# EAGLE design SOLv1.0 (EAGLE 9.6.2)
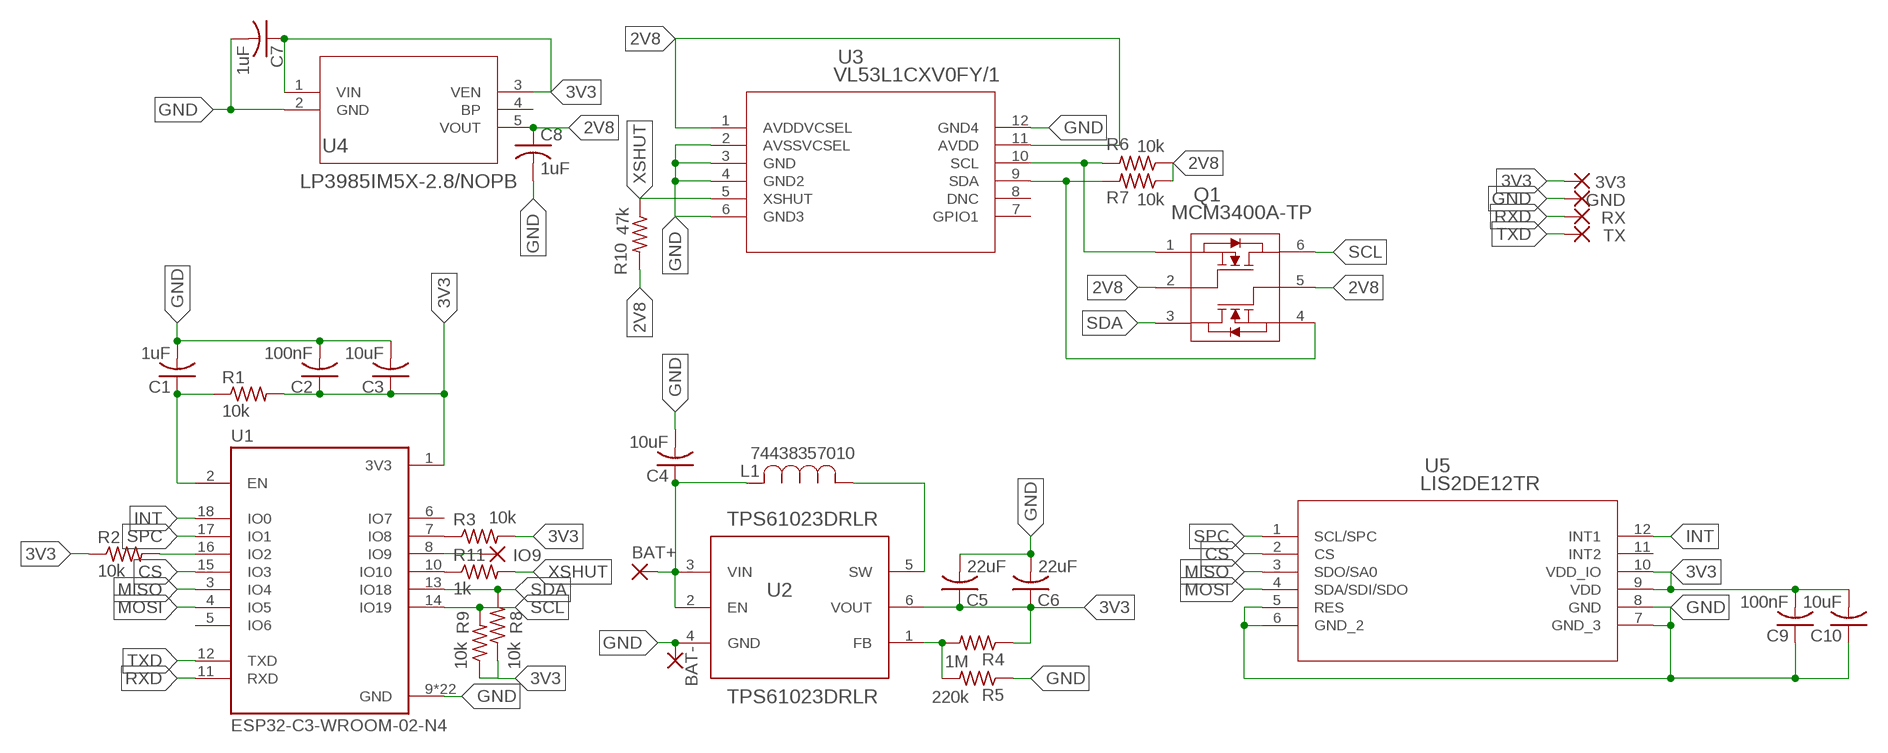
[diagram p0: schematic, sheet 1]

## Parts
3V3  1,6/0,8  [1,6/0,8]
BAT+  1,6/0,8  [1,6/0,8]
BAT-  1,6/0,8  [1,6/0,8]
C1  1uF  C-USC0805  [C0805]
C2  100nF  C-USC0805  [C0805]
C3  10uF  C-USC0805  [C0805]
C4  10uF  C-USC0805  [C0805]
C5  22uF  C-USC0805  [C0805]
C6  22uF  C-USC0805  [C0805]
C7  1uF  C-USC0805  [C0805]
C8  1uF  C-USC0805  [C0805]
C9  100nF  C-USC0805  [C0805]
C10  10uF  C-USC0805  [C0805]
GND  1,6/0,8  [1,6/0,8]
IO9  1,6/0,8  [1,6/0,8]
L1  74438357010  [IND_74438357010_WRE]
Q1  MCM3400A-TP  [DFN2020-6L_MCE]
R1  10k  R-US_R0805  [R0805]
R2  10k  R-US_R0805  [R0805]
R3  10k  R-US_R0805  [R0805]
R4  1M  R-US_R0805  [R0805]
R5  220k  R-US_R0805  [R0805]
R6  10k  R-US_R0805  [R0805]
R7  10k  R-US_R0805  [R0805]
R8  10k  R-US_R0805  [R0805]
R9  10k  R-US_R0805  [R0805]
R10  47k  R-US_R0805  [R0805]
R11  1k  R-US_R0805  [R0805]
RX  1,6/0,8  [1,6/0,8]
TX  1,6/0,8  [1,6/0,8]
U1  ESP32-C3-WROOM-02-N4  [MODULE_ESP32-C3-WROOM-02-H4]
U2  TPS61023DRLR  [DRL0006A]
U3  VL53L1CXV0FY/1  [LGA12_STM]
U4  LP3985IM5X-2.8/NOPB  [MF05A]
U5  LIS2DE12TR  [LGA-12_STM]

## Nets
2V8: C8.1 Q1.2 Q1.5 R6.1 R7.1 R10.2 U3.1(AVDDVCSEL) U3.11(AVDD) U4.5(VOUT)
3V3: 3V3.1(P) C2.1 C3.1 C5.1 C6.1 C7.1 C9.2 C10.2 R1.2 R2.1 R3.2 R4.1 R8.1 R9.1 U1.1(3V3) U2.6(VOUT) U4.1(VIN) U4.3(VEN) U5.9(VDD) U5.10(VDD_IO)
CS: U1.15(IO3) U5.2(CS)
GND: BAT-.1(P) C1.2 C2.2 C3.2 C4.2 C5.2 C6.2 C7.2 C8.2 C9.1 C10.1 GND.1(P) R5.1 U1.9(GND) U1.19(GND) U1.20(GND) U1.21(GND) U1.22(GND) U1.23(GND) U1.24(GND) U1.25(GND) U1.26(GND) U1.27(GND) U1.28(GND) U1.29(GND) U1.30(GND) U1.31(GND) U1.32(GND) U1.33(GND) U1.34(GND) U1.35(GND) U1.36(GND) U1.37(GND) U1.38(GND) U1.39(GND) U2.4(GND) U3.2(AVSSVCSEL) U3.3(GND) U3.4(GND2) U3.6(GND3) U3.12(GND4) U4.2(GND) U5.5(RES) U5.6(GND_2) U5.7(GND_3) U5.8(GND)
INT: U1.18(IO0) U5.12(INT1)
MISO: U1.3(IO4) U5.3(SDO/SA0)
MOSI: U1.4(IO5) U5.4(SDA/SDI/SDO)
N$1: R2.2 U1.16(IO2)
N$2: C1.1 R1.1 U1.2(EN)
N$3: R3.1 U1.7(IO8)
N$4: IO9.1(P) U1.8(IO9)
N$5: BAT+.1(P) C4.1 L1.2 U2.2(EN) U2.3(VIN)
N$6: L1.1 U2.5(SW)
N$7: R4.2 R5.2 U2.1(FB)
N$10: Q1.4 R7.2 U3.9(SDA)
N$11: R11.1 U1.10(IO10)
N$12: Q1.1 R6.2 U3.10(SCL)
RXD: RX.1(P) U1.11(RXD)
SCL: Q1.6 R9.2 U1.14(IO19)
SDA: Q1.3 R8.2 U1.13(IO18)
SPC: U1.17(IO1) U5.1(SCL/SPC)
TXD: TX.1(P) U1.12(TXD)
XSHUT: R10.1 R11.2 U3.5(XSHUT)
Unconnected: U1.5(IO6) U1.6(IO7) U3.7(GPIO1) U3.8(DNC) U4.4(BP) U5.11(INT2)

## Library data of the parts
3V3 BAT+ BAT- GND IO9 RX TX = wirepad:1,6/0,8: THROUGH-HOLE PAD
C1-C10 = rcl:C-US: CAPACITOR, American symbol; SPICEPREFIX: C
L1 = 74438357010:74438357010; COPYRIGHT: Copyright (C) 2024 Ultra Librarian. All rights reserved.; MANUFACTURER_PART_NUMBER: 74438357010; MFR_NAME: Wurth Electronics
Q1 = MCM3400A-TP:MCM3400A-TP; COPYRIGHT: Copyright (C) 2024 Ultra Librarian. All rights reserved.; MANUFACTURER_PART_NUMBER: MCM3400A-TP; MFR_NAME: MCC; TYPE: Transistors
R1-R11 = rcl:R-US_: RESISTOR, American symbol; SPICEPREFIX: R
U1 = ESP32-C3-WROOM-02-N4:ESP32-C3-WROOM-02-N4: WiFi Modules (802.11) (Engineering Samples) SMD module, ESP32-C3, 4MB SPI flash, PCB antenna, -40 C +105 C Check availability <https://pricing.snapeda.com/parts/ESP32-C3-WROOM-02-H4/Espressif%20Systems/view-part?ref=eda> Check availability <https://pricing.snapeda.com/parts/ESP32-C3-WROOM-02-N4/Espressif%20Systems/view-part?ref=eda>; AVAILABILITY: In Stock; CHECK_PRICES: https://www.snapeda.com/parts/ESP32-C3-WROOM-02-N4/Espressif+Systems/view-part/?ref=eda; DESCRIPTION: WiFi Modules (802.11) (Engineering Samples) SMD module, ESP32-C3, 4MB SPI flash, PCB antenna, -40 C +85 C; MF: Espressif Systems; MP: ESP32-C3-WROOM-02-N4; PACKAGE: Package; PRICE: None; SNAPEDA_LINK: https://www.snapeda.com/parts/ESP32-C3-WROOM-02-N4/Espressif+Systems/view-part/?ref=snap
U2 = TPS61023:TPS61023DRLR; COPYRIGHT: Copyright (C) 2024 Ultra Librarian. All rights reserved.; MANUFACTURER_PART_NUMBER: TPS61023DRLR; MFR_NAME: Texas Instruments; REFDES: RefDes; TYPE: TYPE
U3 = VL53L1X:VL53L1CXV0FY/1; COPYRIGHT: Copyright (C) 2024 Ultra Librarian. All rights reserved.; MANUFACTURER_PART_NUMBER: VL53L1CXV0FY/1; MFR_NAME: STMicroelectronics
U4 = LP3985IM5X-2.8:LP3985IM5X-2.8/NOPB; COPYRIGHT: Copyright (C) 2024 Ultra Librarian. All rights reserved.; MANUFACTURER_PART_NUMBER: LP3985IM5X-2.8/NOPB; MFR_NAME: Texas Instruments; TYPE: LP3985IM5-2.5
U5 = LIS2DE12TR:LIS2DE12TR; COPYRIGHT: Copyright (C) 2024 Ultra Librarian. All rights reserved.; MANUFACTURER_PART_NUMBER: LIS2DE12TR; MFR_NAME: STMicroelectronics

## Board
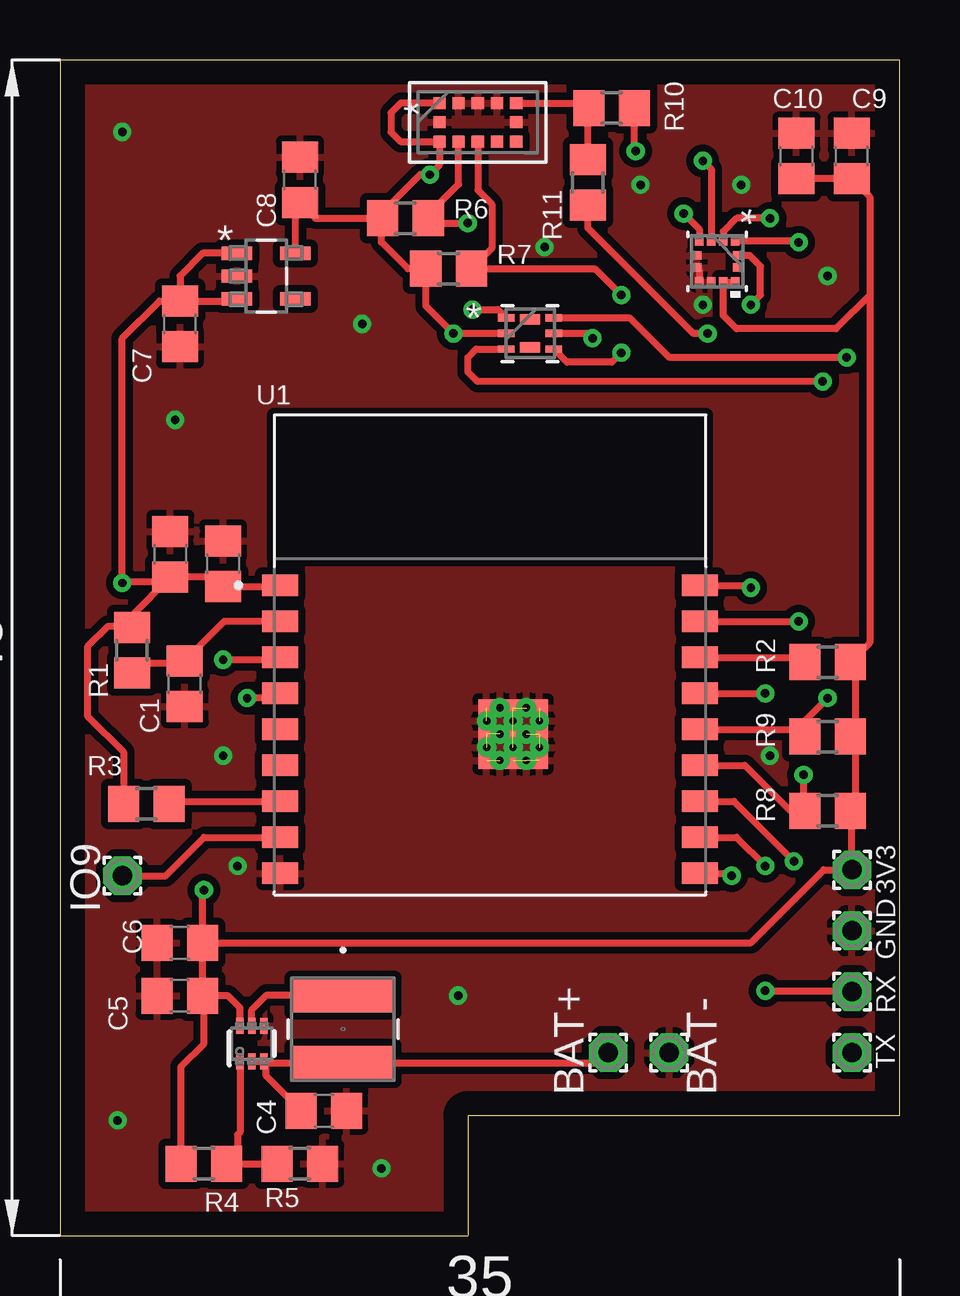
[diagram p1: board, top side]
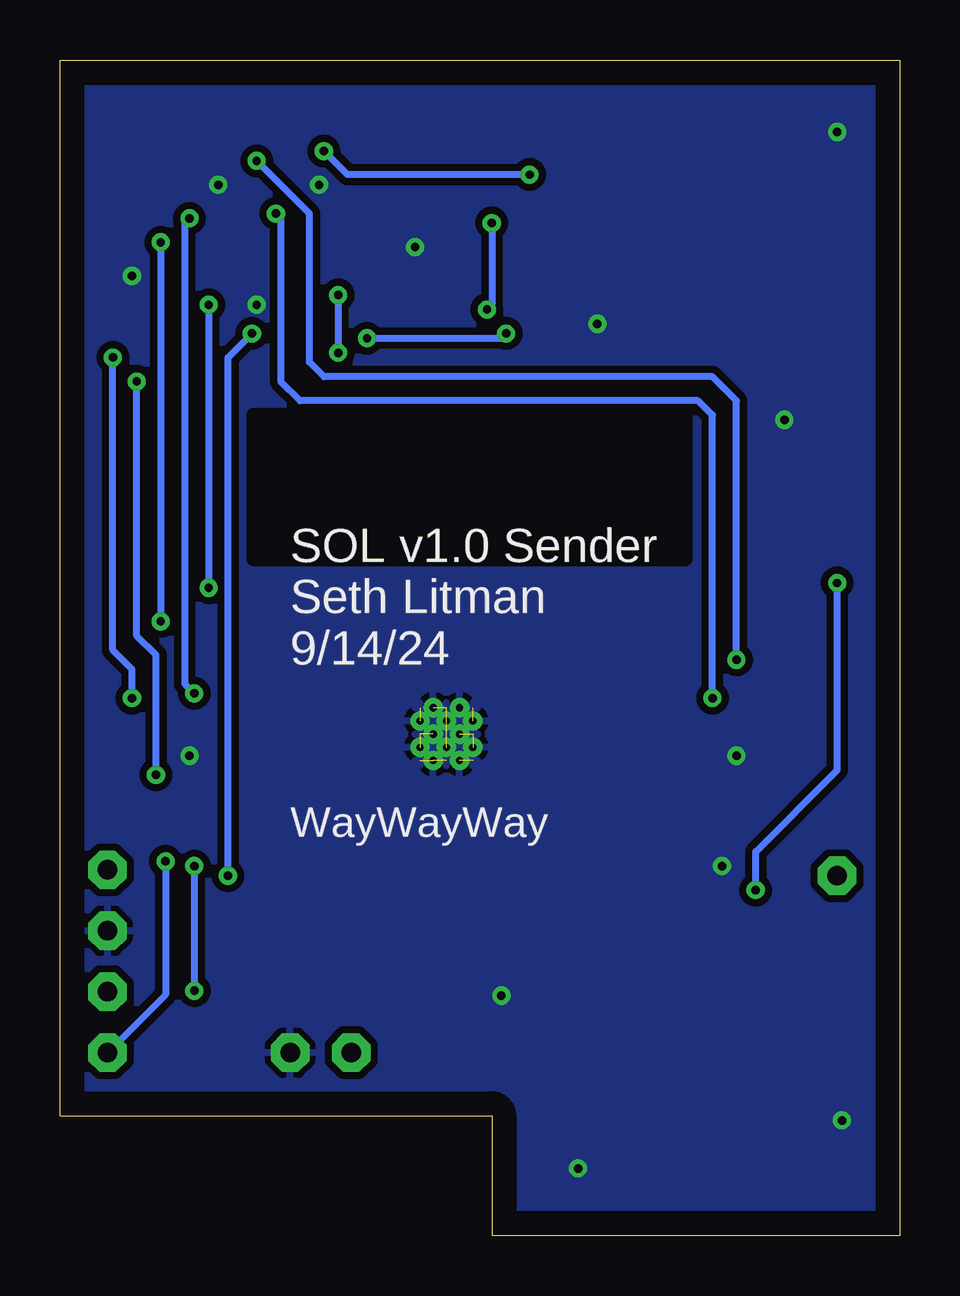
[diagram p2: board, bottom side, seen from below]

Size 35 x 49 mm. Coordinates in mm from the lower left corner, seen from the top.
Outline: 0,0 17,0 17,5 35,5 35,49 0,49 0,0
Copper layers (1*16): Top 0.035mm / dielectric 1.5mm / Bottom 0.035mm
Design rules "default": minimum track width 6mil, minimum drill 0.35mm, track to track 6mil, track to pad 6mil, pad to pad 6mil, via to via 6mil, smd to smd 6mil, copper to edge 40mil, drill to drill 6mil, minimum pad ring 10mil, minimum via ring 8mil, stop-mask expansion 4mil, vias tented up to drill 0mil, thermal gap 10mil

### Footprints (pad centres in the part's own frame; a part is rotated, then mirrored left to right if it is on the bottom)
1,6/0,8 = drill 0.813 pad 1.6 octagon: 1 0,0
C0805 = smd 1.3 x 1.5: 1 -0.95,0; 2 0.95,0
IND_74438357010_WRE = smd 1.448 x 4.293: 1 -1.422,0; 2 1.422,0
DFN2020-6L_MCE = smd 0.686 x 0.305: 1 -0.991,0.65; 2 -0.991,0; 3 -0.991,-0.65; 4 0.991,-0.65; 5 0.991,0; 6 0.991,0.65 | smd 0.84 x 0.44: P$1 0,-0.584; P$2 0,0.584
R0805 = smd 1.3 x 1.5: 1 -0.95,0; 2 0.95,0
MODULE_ESP32-C3-WROOM-02-H4 = smd 1.5 x 0.9: 1 -8.75,2.9; 2 -8.75,1.4; 3 -8.75,-0.1; 4 -8.75,-1.6; 5 -8.75,-3.1; 6 -8.75,-4.6; 7 -8.75,-6.1; 8 -8.75,-7.6; 9 -8.75,-9.1; 10 8.75,-9.1; 11 8.75,-7.6; 12 8.75,-6.1; 13 8.75,-4.6; 14 8.75,-3.1; 15 8.75,-1.6; 16 8.75,-0.1; 17 8.75,1.4; 18 8.75,2.9 | smd 0.7 x 0.7: 19 -0.14,-2.2; 20 0.96,-2.2; 21 2.06,-2.2; 22 -0.14,-3.3; 23 0.96,-3.3; 24 2.06,-3.3; 25 -0.14,-4.4; 26 0.96,-4.4; 27 2.06,-4.4 | drill 0.3 pad 0.4: 28 0.41,-2.2; 29 1.51,-2.2; 30 -0.14,-2.75; 31 0.96,-2.75; 32 2.06,-2.75; 33 0.41,-3.3; 34 1.51,-3.3; 35 -0.14,-3.85; 36 0.96,-3.85; 37 2.06,-3.85; 38 0.41,-4.4; 39 1.51,-4.4
DRL0006A = smd 0.67 x 0.3: 1 -0.74,0.5; 2 -0.74,0; 3 -0.74,-0.5; 4 0.74,-0.5; 5 0.74,0; 6 0.74,0.5
LGA12_STM = smd 0.508 x 0.508: 1 0.8,1.6; 2 0.8,0.8; 3 0.8,0; 4 0.8,-0.8; 5 0.8,-1.6; 6 0,-1.6; 7 -0.8,-1.6; 8 -0.8,-0.8; 9 -0.8,0; 10 -0.8,0.8; 11 -0.8,1.6; 12 0,1.6
MF05A = smd 1.27 x 0.559: 1 -1.219,0.953; 2 -1.219,0; 3 -1.219,-0.953; 4 1.219,-0.953; 5 1.219,0.953
LGA-12_STM = smd 0.381 x 0.356: 1 -0.851,0.75; 2 -0.851,0.25; 3 -0.851,-0.25; 4 -0.851,-0.75; 7 0.851,-0.75; 8 0.851,-0.25; 9 0.851,0.25; 10 0.851,0.75 | smd 0.356 x 0.381: 5 -0.25,-0.851; 6 0.25,-0.851; 11 0.25,0.851; 12 -0.25,0.851

### Placement (x,y rotation side)
3V3  33.02,15.24 0 top
BAT+  22.86,7.62 0 top
BAT-  25.4,7.62 0 top
C1  5.2,23 270 top
C2  6.8,28 90 top
C3  4.6,28.4 90 top
C4  11,5.2 0 top
C5  5,10 180 top
C6  5,12.2 180 top
C7  5,38 270 top
C8  10,44 90 top
C9  33,45 270 top
C10  30.7,45 270 top
GND  33.02,12.7 0 top
IO9  2.6,15 0 top
L1  11.8,8.6 270 top
Q1  19.6,37.6 0 top
R1  3,24.4 90 top
R2  32,23.9 180 top
R3  3.6,18 180 top
R4  6,3 0 top
R5  10,3 180 top
R6  14.4,42.4 0 top
R7  16.2,40.3 0 top
R8  32,17.7 180 top
R9  32,20.8 180 top
R10  23,47 0 top
R11  22,43.9 90 top
RX  33.02,10.16 90 top
TX  33.02,7.62 90 top
U1  17.93,24.2 0 top
U2  8,8 90 top
U3  17.42,46.4 90 top
U4  8.6,39.99 0 top
U5  27.4,40.6 270 top

### Tracks (layer width: path | path; a pad name or v marks a point on that pad's centre or on a via)
2V8  (via drill 0.35)
  Top 0.3: U4.5 9.82,42.87 C8.1 10.65,42.4 13.4,42.4 | U3.1 14.2,47.2 13.8,46.8 13.8,46 14.2,45.6 U3.11 15.82,44.62 v15.42,44.22 15.02,44.22 13.45,42.65 R6.1 13.4,42.4 | v24,45.2 23.95,45.25 R10.2 | 13.4,42.4 13.4,41.4 14.5,40.3 R7.1 15.25,38.75 v16.4,37.6 Q1.2 | v22.2,37.4 22,37.6 Q1.5
  Bottom 0.3: v15.42,44.22 23.02,44.22 v24,45.2 | v22.2,37.4 16.6,37.4 v16.4,37.6
3V3  (via drill 0.35)
  Top 0.3: U2.6 7.5,9.5 7,10 C5.1 | C5.1 C6.1 | U1.1 9.13,27.05 C2.1 6.4,27.45 C3.1 | C3.1 3,25.85 R1.2 2.95,25.4 2,25.4 1.17,24.57 1.17,21.63 2.65,20.15 R3.2 | C6.1 5.95,14.35 v6,14.4 | C3.1 4.4,27.25 2.65,27.25 v2.6,27.2 2.6,37.4 4.15,38.95 C7.1 | C6.1 28.8,12.2 31.84,15.24 3V3.1 33.02,17.63 R8.1 33.15,17.9 33.15,20.6 R9.1 33.15,21 33.15,23.7 R2.1 33.75,24.7 33.75,39.2 | 33.75,39.2 33.75,43.3 C9.2 C10.2 | C7.1 7.29,38.95 U4.3 | U4.1 5.94,40.94 5,40 C7.1 | R4.1 5.05,7.05 6,8 6,9.95 C5.1 | 33.75,39.2 32.35,37.8 28.2,37.8 27.65,38.35 U5.9 U5.10
  Bottom 0.3: v6,14.4 6,16 2.6,19.4 v2.6,27.2
CS  (via drill 0.35)
  Top 0.3: U1.15 v29.4,22.6 | v29.6,42.4 28.2,42.4 27.65,41.85 U5.2
  Bottom 0.3: v29.6,42.4 29.8,42.2 29.8,23 v29.4,22.6
GND  (via drill 0.35)  (13 unrouted)
  Top 0.3: U5.6 26.65,40.25 U5.7
  other vias: 32,40 28.4,43.8 24.2,43.8 20.2,41.2 12.6,38 2.6,46 4.8,34 6.8,20 7.4,15.4 29.6,20 16.6,10 13.4,2.8 2.4,4.8 26.8,38.8
  pour Top (isolate 0.3): 0,0 0,49 35,49 35,5 17,5 17,0
  pour Bottom (isolate 0.3): 0,0 0,49 35,49 35,5 17,5 17,0
INT  (via drill 0.35)
  Top 0.3: U1.18 28.7,27.1 v28.8,27 | v28.8,38.8 29.2,39.2 29.2,40.4 28.75,40.85 U5.12
  Bottom 0.3: v28.8,38.8 v28.8,27
MISO  (via drill 0.35)
  Top 0.3: U1.3 9.08,24 v6.8,24 | v26.8,44.8 27.15,44.45 U5.3
  Bottom 0.3: v6.8,24 6.8,34.8 7.8,35.8 24,35.8 24.6,36.4 24.6,42.6 v26.8,44.8
MOSI  (via drill 0.35)
  Top 0.3: U1.4 8.98,22.4 v7.8,22.4 | v26,42.6 26.65,41.95 U5.4
  Bottom 0.3: v26,42.6 25.8,42.4 25.8,35.6 25,34.8 8.4,34.8 7.8,34.2 v7.8,22.4
N$1
  Top 0.3: U1.16 30.85,24.1 R2.2
N$2
  Top 0.3: U1.2 6.85,25.6 C1.1 5.12,23.88 3.42,23.88 R1.1
N$3
  Top 0.3: R3.1 4.65,18.1 U1.7
N$4
  Top 0.3: IO9.1 4.4,15 6,16.6 U1.8
N$5
  Top 0.3: U2.2 U2.3 | U2.3 8.6,7.26 8.6,6.65 C4.1 | U2.3 8.58,7.18 L1.2 22.42,7.18 BAT+.1
N$6
  Top 0.3: U2.5 8,9.4 8.62,10.02 L1.1
N$7
  Top 0.3: R4.2 7.4,3 | 7.4,3 R5.2 | U2.1 7.5,4.3 7.4,4.2 7.4,3
N$10  (via drill 0.35)
  Top 0.3: U3.9 17.42,43.58 18,43 18,41.15 R7.2 22.3,40.3 v23.4,39.2 | v23.4,36.8 23,36.4 21.14,36.4 Q1.4
  Bottom 0.3: v23.4,39.2 v23.4,36.8
N$11  (via drill 0.35)
  Top 0.3: U1.10 27.9,15.1 v28,15 | v27,37.6 26.4,37.6 22,42 R11.1
  Bottom 0.3: v27,37.6 28,36.6 v28,15
N$12  (via drill 0.35)
  Top 0.3: U3.10 16.62,43.82 15.35,42.55 R6.2 15.55,42.2 v17,42.2 | v17.2,38.6 18.26,38.6 Q1.1
  Bottom 0.3: v17,42.2 17,38.8 v17.2,38.6
RXD  (via drill 0.35)
  Top 0.3: U1.11 28.2,16.6 v29.4,15.4 | v29.4,10.2 32.98,10.2 RX.1
  Bottom 0.3: v29.4,15.4 v29.4,10.2
SCL  (via drill 0.35)
  Top 0.3: U1.14 30.75,21.1 R9.2 31.05,21.45 v32,22.4 | v32.8,36.6 25.4,36.6 23.75,38.25 Q1.6
  Bottom 0.3: v32,22.4 32,23.6 32.8,24.4 v32.8,36.6
SDA  (via drill 0.35)
  Top 0.3: U1.13 28.55,19.6 30.45,17.7 R8.2 31,17.75 v31,19.2 | v31.8,35.6 17.4,35.6 17,36 17,36.6 17.35,36.95 Q1.3
  Bottom 0.3: v31,19.2 31,24.2 31.8,25 v31.8,35.6
SPC  (via drill 0.35)
  Top 0.3: U1.17 v30.8,25.6 | v30.8,41.4 30.75,41.45 U5.1
  Bottom 0.3: v30.8,41.4 v30.8,25.6
TXD  (via drill 0.35)
  Top 0.3: U1.12 28.1,18.1 v30.6,15.6
  Bottom 0.3: v30.6,15.6 30.6,10.04 TX.1
XSHUT
  Top 0.3: U3.5 21.85,47.2 R10.1 22,46.95 R11.2

### Text on the board
bPlace: SOL v1.0 Sender / Seth Litman / 9/14/24 | WayWayWay